# Altium schematic sheet 指纹解锁.SchDoc
size A4
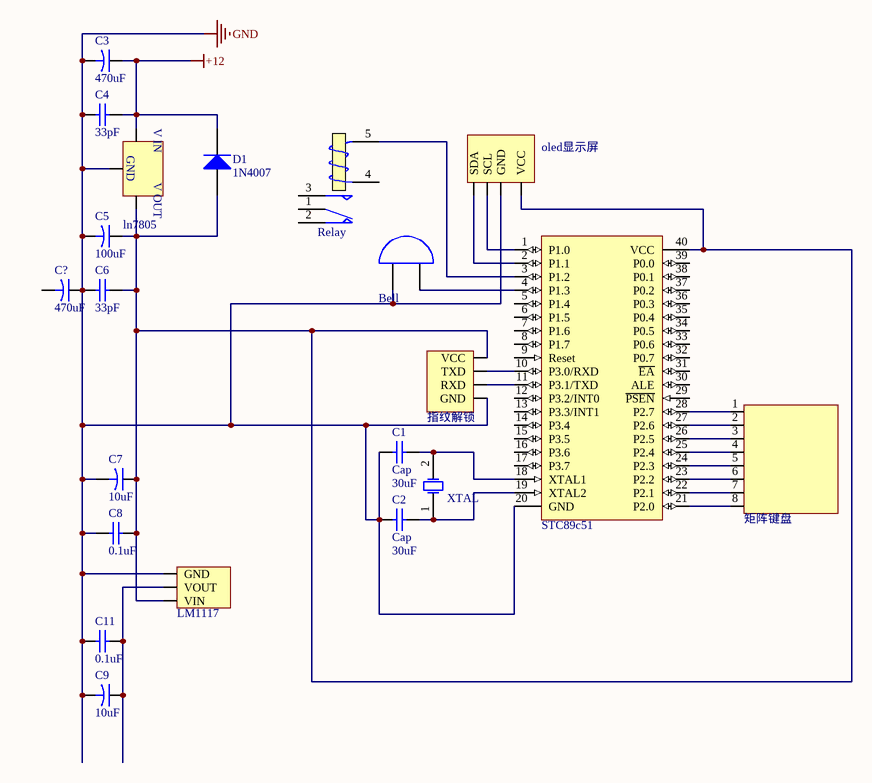
[diagram p0: 指纹解锁.SchDoc]

## Parts
1  oled显示屏
2  矩阵键盘
4  LM1117
*  指纹解锁
*?  ln7805
C1  Cap  value 30uF  [RAD-0.3]
C2  Cap  value 30uF  [RAD-0.3]
C3  value 470uF  [CAPR5-4X5]  (hidden comment: Cap2)
C4  value 33pF  [C1206]  (hidden comment: Cap Semi)
C5  value 100uF  [CAPR5-4X5]  (hidden comment: Cap2)
C6  value 33pF  [C1206]  (hidden comment: Cap Semi)
C7  value 10uF  [CAPR5-4X5]  (hidden comment: Cap2)
C8  value 0.1uF  [C1206]  (hidden comment: Cap Semi)
C9  value 10uF  [CAPR5-4X5]  (hidden comment: Cap2)
c10  STC89c51  (part C of 3)
C11  value 0.1uF  [C1206]  (hidden comment: Cap Semi)
C?  value 470uF  [CAPR5-4X5]  (hidden comment: Cap2)
D1  1N4007  [DO-35]
K1  Relay  [MODULE5B]
LS?  Bell  [PIN2]
Y1  XTAL  [R38]

## Nets
+12: C3.1 C4.2 D1.2(K)
GND: 1.27(GND) 4.10(GND) *.GND C1.1 C2.1 C3.2 C4.1 C5.2 C6.1 C7.2 C8.1 C9.2 c10.20(GND) C11.1 C?.1 LS?.1(A)
Net1_25: 1.25(SDA) c10.2(P1.1)
Net1_26: 1.26(SCL) c10.1(P1.0)
Net1_28: 1.28(VCC) 4.10(VIN) *.VCC *?.19 C5.1 C6.2 C7.1 C8.2 c10.40(VCC) D1.1(A)
Net2_1: 2.1(p1) c10.28(P2.7)
Net2_2: 2.2(p2) c10.27(P2.6)
Net2_3: 2.3(p3) c10.26(P2.5)
Net2_4: 2.4(p4) c10.25(P2.4)
Net2_5: 2.5(p5) c10.24(P2.3)
Net2_6: 2.6(p6) c10.23(P2.2)
Net2_7: 2.7(p7) c10.22(P2.1)
Net2_8: 2.8(p8) c10.21(P2.0)
Net4_10: 4.10(VOUT) C9.1 C11.2
Net*_RXD: *.RXD c10.11(P3.1/TXD)
Net*_TXD: *.TXD c10.10(P3.0/RXD)
NetC1_2: C1.2 c10.18(XTAL1) Y1.2(OSC2)
NetC2_2: C2.2 c10.19(XTAL2) Y1.1(OSC1)
Netc10_3: c10.3(P1.2) K1.5(T2)
Netc10_4: c10.4(P1.3) LS?.2(B)

Not connected (* = marked no-connect by the designer): *? 18 20; c10 5(P1.4) 6(P1.5) 7(P1.6) 8(P1.7) 9(Reset) 12(P3.2/INT0) 13(P3.3/INT1) 14(P3.4) 15(P3.5) 16(P3.6) 17(P3.7) 29(~{PSEN}) 30(ALE) 31(~{EA}) 32(P0.7) 33(P0.6) 34(P0.5) 35(P0.4) 36(P0.3) 37(P0.2) 38(P0.1) 39(P0.0); C? 2; K1 1(COM) 2(NC) 3(NO) 4(T1)

## Notes on the sheet
- (in symbol ln7805) V IN; GND; V OUT

## Library data of the parts
C1 C2 = Cap: Capacitor; Published: 8-Jun-2000; LatestRevisionDate: 17-Jul-2002; LatestRevisionNote: Re-released for DXP Platform.; PackageReference: RAD-0.3; Publisher: Altium Limited; PackageDescription: Radial Cap, Thru-Hole; 2 Leads; 0.3 in Pin Spacing
C3 C5 C7 C9 C? = Cap2: Capacitor; Published: 23-Sep-2002; PackageReference: CAPR5-4X5; Publisher: Altium Limited; PackageDescription: Capacitor; 2 Leads
C4 C6 C8 C11 = Cap Semi: Capacitor (Semiconductor SIM Model); Published: 8-Jun-2000; LatestRevisionDate: 29-May-2009; LatestRevisionNote: IPC-7351 Footprint Added.; PackageReference: C1206; Publisher: Altium Limited; PackageDescription: Chip Capacitor
D1 = Diode 1N914: High Conductance Fast Diode; Published: 8-Jun-2000; LatestRevisionDate: 17-Jul-2002; LatestRevisionNote: Re-released for DXP Platform.; DatasheetVersion: 1997; PackageReference: DO-35; Publisher: Altium Limited; PackageDescription: Diode, Axial; Body 3.8 x 1.9 mm (LxDia. max), Lead Dia. 0.53 mm (max); Code_JEDEC: DO-204-AH; ComponentLink1Description: Manufacturer Link; ComponentLink1URL: http://www.fairchildsemi.com/; ComponentLink2Description: Datasheet; ComponentLink2URL: http://www.fairchildsemi.com/ds/1N%2F1N4448.pdf
K1 = Relay: SPDT Relay; Published: 8-Jun-2000; LatestRevisionDate: 17-Jul-2002; LatestRevisionNote: Re-released for DXP Platform.; PackageReference: MODULE5B; Publisher: Altium Limited
LS? = Bell: Electrical Bell; Published: 24-Mar-1999; LatestRevisionDate: 17-Jul-2002; LatestRevisionNote: Re-released for DXP Platform.; PackageReference: PIN2; Publisher: Altium Limited
Y1 = XTAL: Crystal Oscillator; Published: 8-Jun-2000; LatestRevisionDate: 17-Jul-2002; LatestRevisionNote: Re-released for DXP Platform.; PackageReference: R38; Publisher: Altium Limited; PackageDescription: Crystal, Thru-Hole; 2 Leads; Body 3.1 x 8.2 mm (Dia.xH)